# EAGLE design anode_pcb (EAGLE 6.6.0)
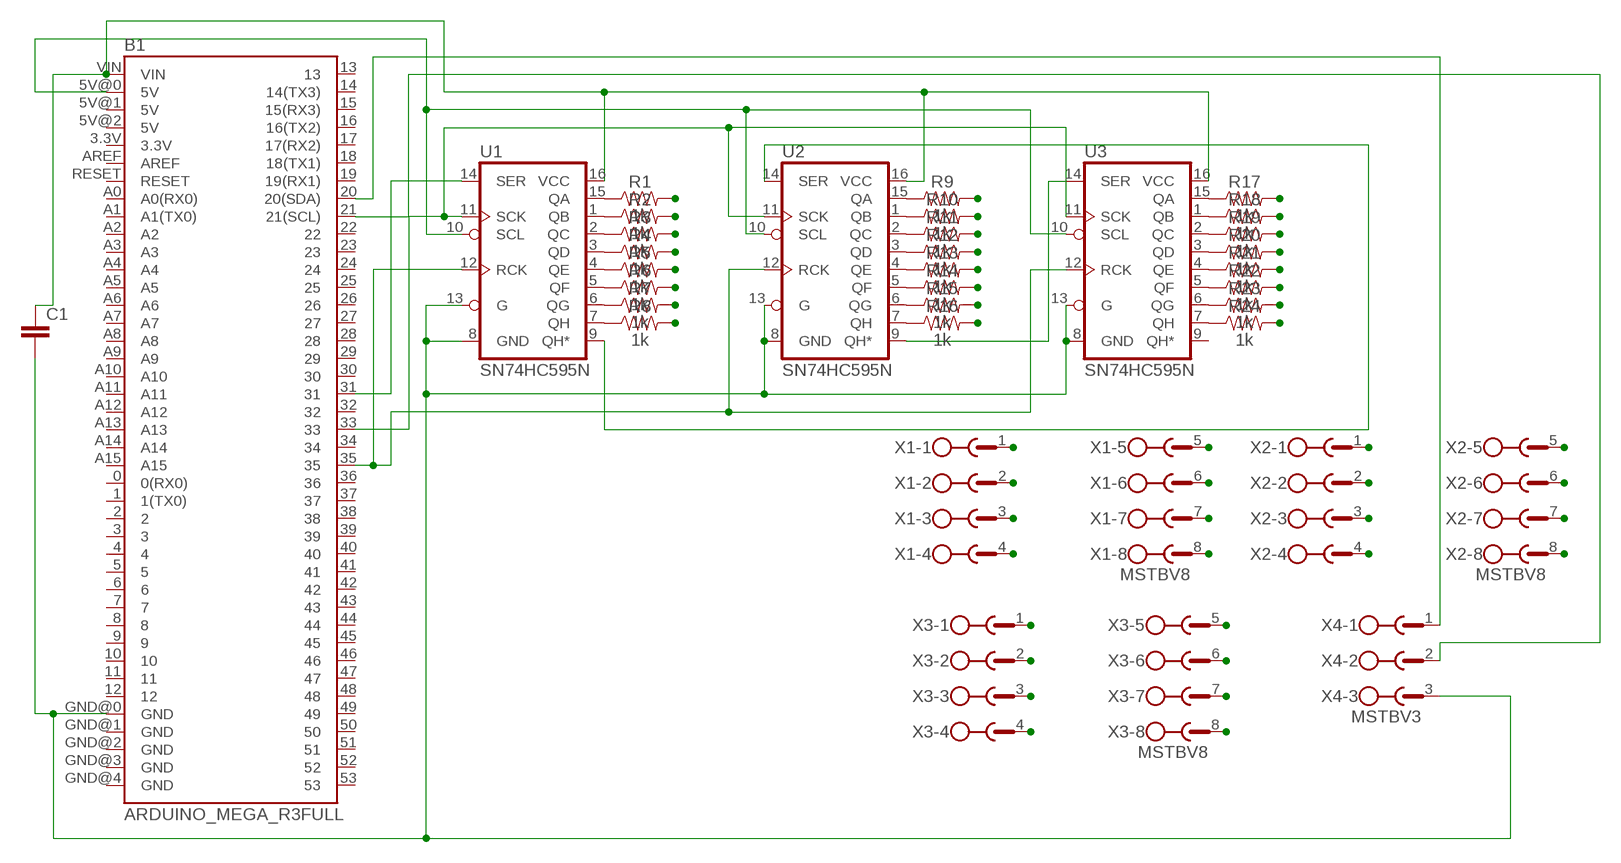
[diagram p0: schematic, sheet 1]

## Parts
B1  ARDUINO_MEGA_R3FULL  [ARDUINO_MEGA]
C1  C2.5/2  [C2.5-2]
R1  1k  1KOHM-HORIZ-1/4W-5%  [AXIAL-0.3]
R2  1k  1KOHM-HORIZ-1/4W-5%  [AXIAL-0.3]
R3  1k  1KOHM-HORIZ-1/4W-5%  [AXIAL-0.3]
R4  1k  1KOHM-HORIZ-1/4W-5%  [AXIAL-0.3]
R5  1k  1KOHM-HORIZ-1/4W-5%  [AXIAL-0.3]
R6  1k  1KOHM-HORIZ-1/4W-5%  [AXIAL-0.3]
R7  1k  1KOHM-HORIZ-1/4W-5%  [AXIAL-0.3]
R8  1k  1KOHM-HORIZ-1/4W-5%  [AXIAL-0.3]
R9  1k  1KOHM-HORIZ-1/4W-5%  [AXIAL-0.3]
R10  1k  1KOHM-HORIZ-1/4W-5%  [AXIAL-0.3]
R11  1k  1KOHM-HORIZ-1/4W-5%  [AXIAL-0.3]
R12  1k  1KOHM-HORIZ-1/4W-5%  [AXIAL-0.3]
R13  1k  1KOHM-HORIZ-1/4W-5%  [AXIAL-0.3]
R14  1k  1KOHM-HORIZ-1/4W-5%  [AXIAL-0.3]
R15  1k  1KOHM-HORIZ-1/4W-5%  [AXIAL-0.3]
R16  1k  1KOHM-HORIZ-1/4W-5%  [AXIAL-0.3]
R17  1k  1KOHM-HORIZ-1/4W-5%  [AXIAL-0.3]
R18  1k  1KOHM-HORIZ-1/4W-5%  [AXIAL-0.3]
R19  1k  1KOHM-HORIZ-1/4W-5%  [AXIAL-0.3]
R20  1k  1KOHM-HORIZ-1/4W-5%  [AXIAL-0.3]
R21  1k  1KOHM-HORIZ-1/4W-5%  [AXIAL-0.3]
R22  1k  1KOHM-HORIZ-1/4W-5%  [AXIAL-0.3]
R23  1k  1KOHM-HORIZ-1/4W-5%  [AXIAL-0.3]
R24  1k  1KOHM-HORIZ-1/4W-5%  [AXIAL-0.3]
U1  SN74HC595N  74HC595N  [DIP16]
U2  SN74HC595N  74HC595N  [DIP16]
U3  SN74HC595N  74HC595N  [DIP16]
X1  MSTBV8  [MSTBV8]
X2  MSTBV8  [MSTBV8]
X3  MSTBV8  [MSTBV8]
X4  MSTBV3  [MSTBV3]

## Nets
A1: R1.P$2 X1.1
A2: R2.P$2 X1.2
A3: R3.P$2 X1.3
A4: R4.P$2 X1.4
A5: R5.P$2 X1.5
A6: R6.P$2 X1.6
A7: R7.P$2 X1.7
A8: R8.P$2 X1.8
A9: R9.P$2 X2.1
A10: R10.P$2 X2.2
A11: R11.P$2 X2.3
A12: R12.P$2 X2.4
A13: R13.P$2 X2.5
A14: R14.P$2 X2.6
A15: R15.P$2 X2.7
A16: R16.P$2 X2.8
A17: R17.P$2 X3.1
A18: R18.P$2 X3.2
A19: R19.P$2 X3.3
A20: R20.P$2 X3.4
A21: R21.P$2 X3.5
A22: R22.P$2 X3.6
A23: R23.P$2 X3.7
A24: R24.P$2 X3.8
N$1: B1.5V@0(5V) U1.10(SCL) U2.10(SCL) U3.10(SCL)
N$2: R1.P$1 U1.15(QA)
N$3: B1.GND@0(GND) C1.2 U1.8(GND) U1.13(G) U2.8(GND) U2.13(G) U3.8(GND) U3.13(G) X4.3
N$4: R2.P$1 U1.1(QB)
N$5: R4.P$1 U1.3(QD)
N$6: R5.P$1 U1.4(QE)
N$7: R6.P$1 U1.5(QF)
N$8: R3.P$1 U1.2(QC)
N$9: R7.P$1 U1.6(QG)
N$10: R8.P$1 U1.7(QH)
N$11: B1.20(20(SDA)) X4.1
N$12: B1.21(21(SCL)) X4.2
N$19: R9.P$1 U2.15(QA)
N$20: R10.P$1 U2.1(QB)
N$21: R11.P$1 U2.2(QC)
N$22: R12.P$1 U2.3(QD)
N$23: R13.P$1 U2.4(QE)
N$24: R14.P$1 U2.5(QF)
N$25: R15.P$1 U2.6(QG)
N$26: R16.P$1 U2.7(QH)
N$27: R17.P$1 U3.15(QA)
N$28: R18.P$1 U3.1(QB)
N$29: R19.P$1 U3.2(QC)
N$30: R20.P$1 U3.3(QD)
N$31: R21.P$1 U3.4(QE)
N$32: R22.P$1 U3.5(QF)
N$33: R23.P$1 U3.6(QG)
N$34: R24.P$1 U3.7(QH)
N$51: B1.33 U1.11(SCK) U2.11(SCK) U3.11(SCK)
N$52: U2.9(QH*) U3.14(SER)
N$53: U1.9(QH*) U2.14(SER)
N$54: B1.31 U1.14(SER)
N$56: B1.35 U1.12(RCK) U2.12(RCK) U3.12(RCK)
N$59: B1.VIN C1.1 U1.16(VCC) U2.16(VCC) U3.16(VCC)
Unconnected: B1.0(0(RX0)) B1.1(1(TX0)) B1.2 B1.3 B1.3.3V B1.4 B1.5 B1.5V@1(5V) B1.5V@2(5V) B1.6 B1.7 B1.8 B1.9 B1.10 B1.11 B1.12 B1.13 B1.14(14(TX3)) B1.15(15(RX3)) B1.16(16(TX2)) B1.17(17(RX2)) B1.18(18(TX1)) B1.19(19(RX1)) B1.22 B1.23 B1.24 B1.25 B1.26 B1.27 B1.28 B1.29 B1.30 B1.32 B1.34 B1.36 B1.37 B1.38 B1.39 B1.40 B1.41 B1.42 B1.43 B1.44 B1.45 B1.46 B1.47 B1.48 B1.49 B1.50 B1.51 B1.52 B1.53 B1.A0(A0(RX0)) B1.A1(A1(TX0)) B1.A2 B1.A3 B1.A4 B1.A5 B1.A6 B1.A7 B1.A8 B1.A9 B1.A10 B1.A11 B1.A12 B1.A13 B1.A14 B1.A15 B1.AREF B1.GND@1(GND) B1.GND@2(GND) B1.GND@3(GND) B1.GND@4(GND) B1.RESET U3.9(QH*)

## Library data of the parts
B1 = SparkFun-Boards:ARDUINO_MEGA_R3: Arduino Mega R3 ATmega2560 R3 compatible footprint. SparkFun Products: Arduino Mega 2560 R3 <https://www.sparkfun.com/products/11061>
C1 = capacitor-wima:C: CAPACITOR naming: grid - package width
R1-R24 = SparkFun-Resistors:1KOHM: 1kΩ resistor A resistor is a passive two-terminal electrical component that implements electrical resistance as a circuit element. Resistors act to reduce current flow, and, at the same time, act to lower voltage levels within circuits. - Wikipedia; PROD_ID: RES-08380
U1-U3 = SparkFun-IC-Logic:74*595: 8-Bit Shift Register (Serial to Parallel) Datasheet <http://cdn.sparkfun.com/datasheets/BreakoutBoards/MM74HC595.pdf> SparkFun Products SparkFun Shift Register Breakout - 74HC595 <https://www.sparkfun.com/products/10680> (BOB-10680); PROD_ID: IC-13123
X1-X3 = con-phoenix-508:MSTBV8: PHOENIX; MPN: MSTBV 2,5/8-GF-5.08; OC_FARNELL: 1792797; OC_NEWARK: 69R9850
X4 = con-phoenix-508:MSTBV3: PHOENIX; MPN: MSTBV 2,5/3-GF-5.08; OC_FARNELL: 1792793; OC_NEWARK: 69R9846

## Board
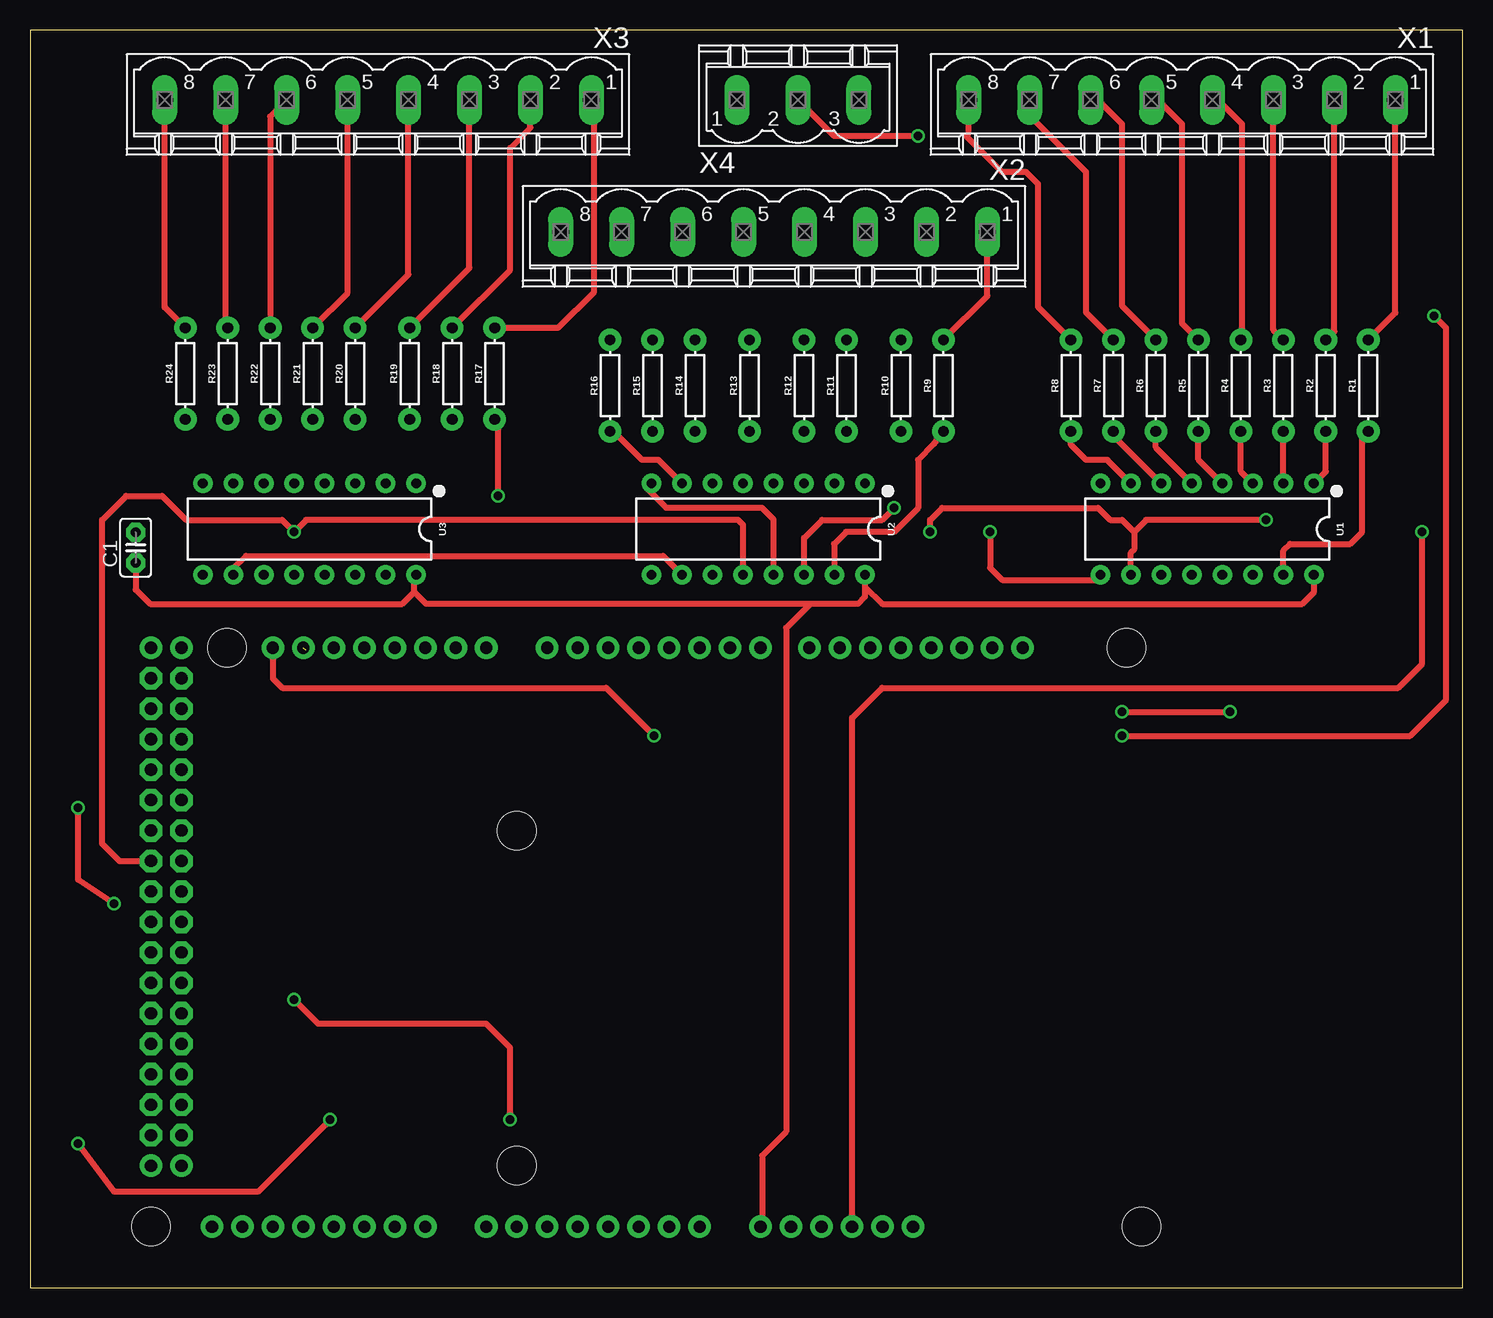
[diagram p1: board, top side]
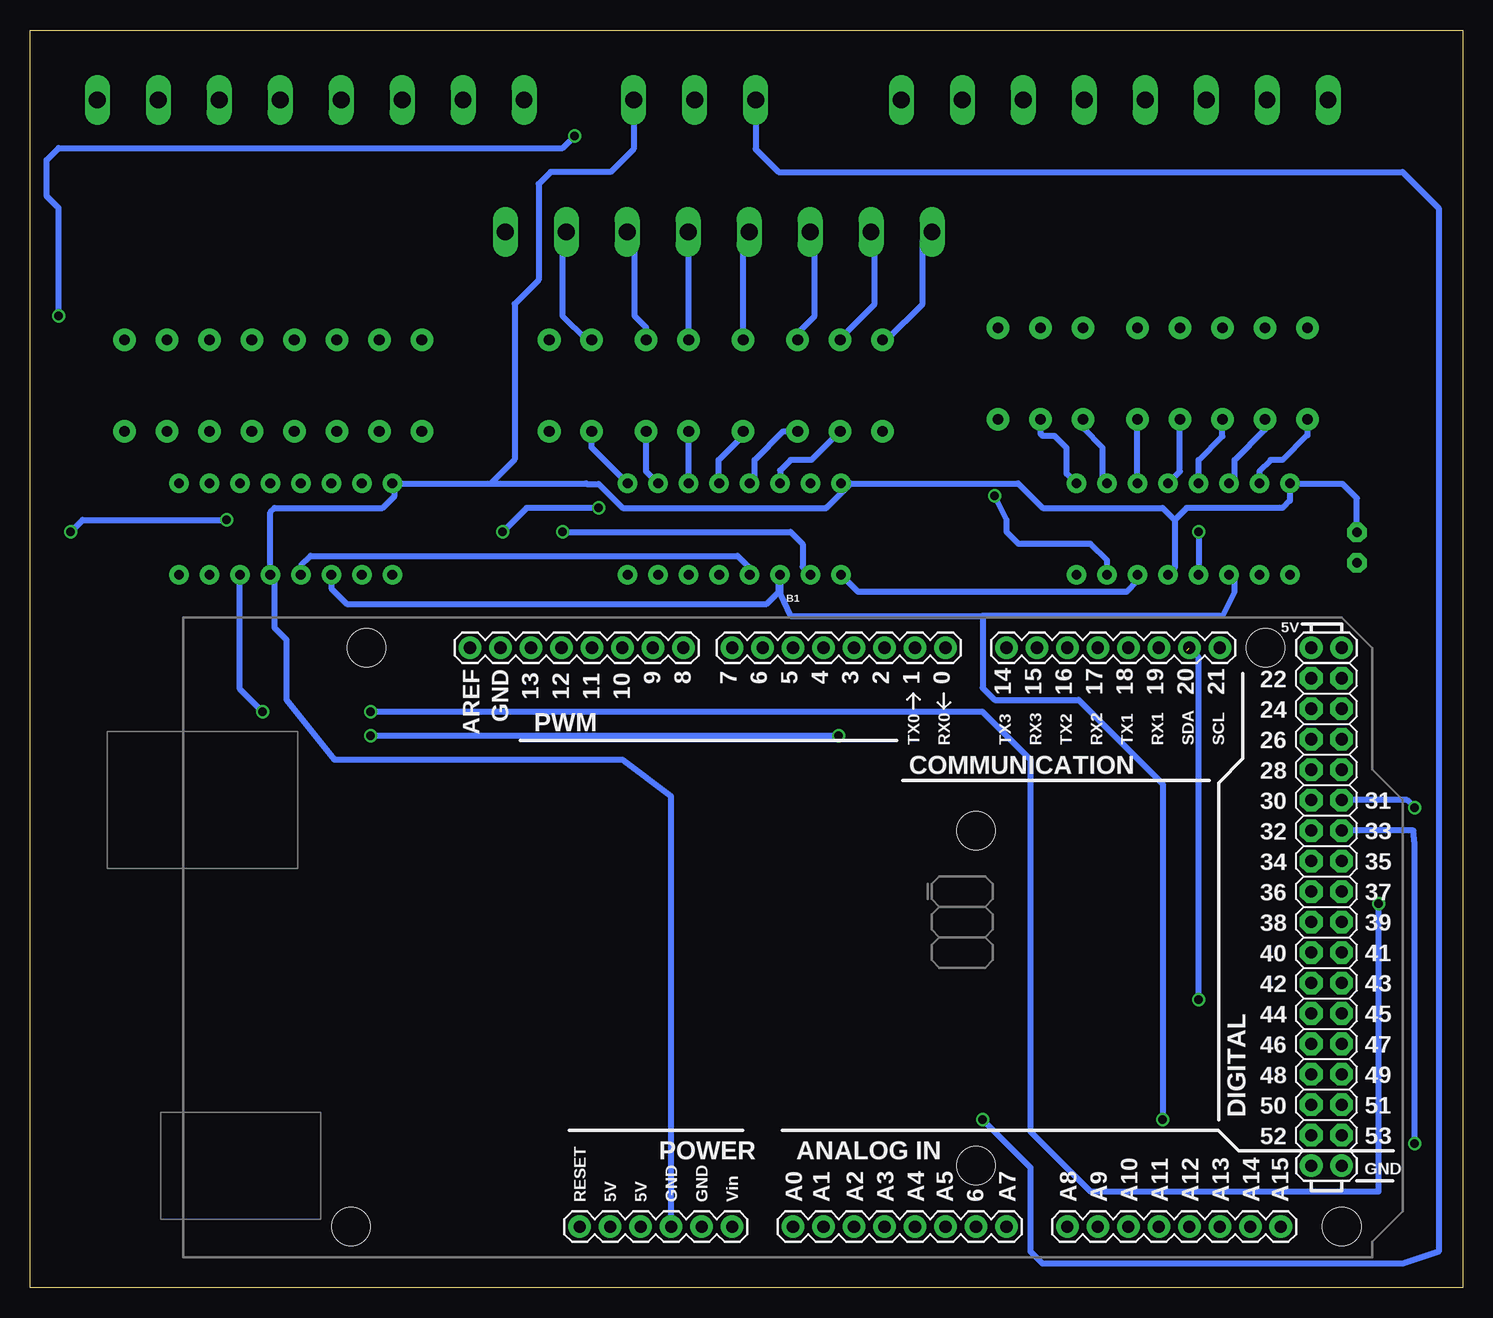
[diagram p2: board, bottom side, seen from below]

Size 119.39 x 104.84 mm. Coordinates in mm from the lower left corner, seen from the top.
Outline: 0,0 119.39,0 119.39,104.84 0,104.84 0,0
Copper layers (1*16): Top 0.035mm / dielectric 1.5mm / Bottom 0.035mm
Design rules "default": minimum track width 10mil, minimum drill 24mil, track to track 8mil, track to pad 8mil, pad to pad 8mil, via to via 8mil, smd to smd 8mil, copper to edge 40mil, drill to drill 8mil, minimum pad ring 10mil, minimum via ring 8mil, stop-mask expansion 4mil, vias tented up to drill 0mil, thermal gap 10mil

### Footprints (pad centres in the part's own frame; a part is rotated, then mirrored left to right if it is on the bottom)
ARDUINO_MEGA = drill 1.016 pad 1.88: 0 13.97,24.13; 1 11.43,24.13; 2 8.89,24.13; 3 6.35,24.13; 3.3V -13.97,-24.13; 4 3.81,24.13; 5 1.27,24.13; 5V@0 -11.43,-24.13; 5V@1 44.45,24.13; 5V@2 46.99,24.13; 6 -1.27,24.13; 7 -3.81,24.13; 8 -7.874,24.13; 9 -10.414,24.13; 10 -12.954,24.13; 11 -15.494,24.13; 12 -18.034,24.13; 13 -20.574,24.13; 14 19.05,24.13; 15 21.59,24.13; 16 24.13,24.13; 17 26.67,24.13; 18 29.21,24.13; 19 31.75,24.13; 20 34.29,24.13; 21 36.83,24.13; A0 1.27,-24.13; A1 3.81,-24.13; A2 6.35,-24.13; A3 8.89,-24.13; A4 11.43,-24.13; A5 13.97,-24.13; A6 16.51,-24.13; A7 19.05,-24.13; A8 24.13,-24.13; A9 26.67,-24.13; A10 29.21,-24.13; A11 31.75,-24.13; A12 34.29,-24.13; A13 36.83,-24.13; A14 39.37,-24.13; A15 41.91,-24.13; AREF -25.654,24.13; GND@0 -8.89,-24.13; GND@1 -6.35,-24.13; GND@2 44.45,-19.05; GND@3 46.99,-19.05; GND@4 -23.114,24.13; RESET -16.51,-24.13; VIN -3.81,-24.13 | drill 1.016 pad 1.88 octagon: 22 44.45,21.59; 23 46.99,21.59; 24 44.45,19.05; 25 46.99,19.05; 26 44.45,16.51; 27 46.99,16.51; 28 44.45,13.97; 29 46.99,13.97; 30 44.45,11.43; 31 46.99,11.43; 32 44.45,8.89; 33 46.99,8.89; 34 44.45,6.35; 35 46.99,6.35; 36 44.45,3.81; 37 46.99,3.81; 38 44.45,1.27; 39 46.99,1.27; 40 44.45,-1.27; 41 46.99,-1.27; 42 44.45,-3.81; 43 46.99,-3.81; 44 44.45,-6.35; 45 46.99,-6.35; 46 44.45,-8.89; 47 46.99,-8.89; 48 44.45,-11.43; 49 46.99,-11.43; 50 44.45,-13.97; 51 46.99,-13.97; 52 44.45,-16.51; 53 46.99,-16.51 | hole 3.2: -34.29,24.13; -35.56,-24.13; 16.51,8.89; 16.51,-19.05; 40.64,24.13; 46.99,-24.13
C2.5-2 = drill 0.813 pad 1.6 octagon: 1 -1.27,0; 2 1.27,0
AXIAL-0.3 = drill 0.9 pad 1.88: P$1 -3.81,0; P$2 3.81,0
DIP16 = drill 0.813 pad 1.626: 1 -8.89,-3.81; 2 -6.35,-3.81; 3 -3.81,-3.81; 4 -1.27,-3.81; 5 1.27,-3.81; 6 3.81,-3.81; 7 6.35,-3.81; 8 8.89,-3.81; 9 8.89,3.81; 10 6.35,3.81; 11 3.81,3.81; 12 1.27,3.81; 13 -1.27,3.81; 14 -3.81,3.81; 15 -6.35,3.81; 16 -8.89,3.81
MSTBV8 = drill 1.397 long: 1 -17.78,0; 2 -12.7,0; 3 -7.62,0; 4 -2.54,0; 5 2.54,0; 6 7.62,0; 7 12.7,0; 8 17.78,0
MSTBV3 = drill 1.397 long: 1 -5.08,0; 2 0,0; 3 5.08,0

### Placement (x,y rotation side)
B1  57.07,29.21 0 bottom
C1  8.81,61.69 90 top
R1  111.52,75.2 90 top
R2  107.98,75.2 90 top
R3  104.44,75.2 90 top
R4  100.9,75.2 90 top
R5  97.36,75.2 90 top
R6  93.82,75.2 90 top
R7  90.28,75.2 90 top
R8  86.74,75.2 90 top
R9  76.12,75.2 90 top
R10  72.58,75.2 90 top
R11  68.04,75.2 90 top
R12  64.5,75.2 90 top
R13  59.96,75.2 90 top
R14  55.42,75.2 90 top
R15  51.88,75.2 90 top
R16  48.34,75.2 90 top
R17  38.72,76.2 90 top
R18  35.18,76.2 90 top
R19  31.64,76.2 90 top
R20  27.1,76.2 90 top
R21  23.56,76.2 90 top
R22  20.02,76.2 90 top
R23  16.48,76.2 90 top
R24  12.94,76.2 90 top
U1  98.09,63.23 180 top
U2  60.69,63.23 180 top
U3  23.29,63.23 180 top
X1  96,99 180 top
X2  62,88 180 top
X3  29,99 180 top
X4  64,99 0 top

### Tracks (layer width: path | path; a pad name or v marks a point on that pad's centre or on a via)
A1
  Top 0.5: R1.P$2 113.78,81.27 X1.1
A2
  Top 0.5: R2.P$2 108.7,79.73 X1.2
A3
  Top 0.5: R3.P$2 103.62,79.83 X1.3
A4
  Top 0.5: R4.P$2 101,79.11 101,97 99,99 X1.4
A5
  Top 0.5: R5.P$2 96,80.37 96,97 94,99 X1.5
A6
  Top 0.5: R6.P$2 91,81.83 91,97 89,99 X1.6
A7
  Top 0.5: R7.P$2 88,81.29 88,93 83.3,97.7 X1.7
A8
  Top 0.5: R8.P$2 84,81.75 84,92 83,93 81,93 78,96 78.22,96.22 X1.8
A9
  Top 0.5: R9.P$2 79.78,82.67 X2.1
A10
  Bottom 0.5: R10.P$2 73.01,79.01 75,81 75,87.7 X2.2
A11
  Bottom 0.5: R11.P$2 68.04,80.04 69,81 69,87.38 X2.3
A12
  Bottom 0.5: R12.P$2 64.5,87.96 X2.4
A13
  Bottom 0.5: R13.P$2 59.96,87.5 X2.5
A14
  Bottom 0.5: R14.P$2 55.42,79.58 54,81 54,87.62 X2.6
A15
  Bottom 0.5: R15.P$2 51.88,79.12 49,82 49,87.7 X2.7
A16
  Bottom 0.5: R16.P$2 47.99,79.01 45,82 45,87.22 X2.8
A17
  Top 0.5: R17.P$2 44.01,80.01 47,83 47,98.78 X3.1
A18
  Top 0.5: R18.P$2 40,84.83 40,95 41.7,96.7 X3.2
A19
  Top 0.5: R19.P$2 36.62,84.99 X3.3
A20
  Top 0.5: R20.P$2 31.54,84.45 X3.4
A21
  Top 0.5: R21.P$2 26.46,82.91 X3.5
A22
  Top 0.5: X3.6 20.02,97.64 R22.P$2
A23
  Top 0.5: R23.P$2 16.3,80.19 X3.7
A24
  Top 0.5: R24.P$2 11.22,81.73 X3.8
N$1  (via drill 0.7)
  Top 0.5: U3.10 16.94,59.94 18,61 52.76,61 U2.10 | U1.10 91.74,61.26 92,61.52 92,63 | v75,63 75,64 76,65 89,65 90,64 91,64 92,63 | B1.5V@0 68.5,47.5 71,50 114,50 116,52 v116,63 | v103,64 93,64 92,63
  Bottom 0.5: v75,63 56,63 55,62 55,60.08 U2.10 | v116,63 115,64 v103,64
N$2
  Top 0.5: U1.15 104.44,61.44 105,62 110,62 111,63 111,70.87 R1.P$1
N$3
  Top 0.5: U2.13 61.96,64.04 61,65 53,65 53,65.04 51.52,66.52 51.52,66.76 U2.8
  Bottom 0.5: C1.2 8.81,65.81 10,67 14.36,67 U3.8 14.4,65.6 15,65 23,65 24,64 | 24,64 24,59.98 U3.13 | U2.8 51,67.04 | 81,67.04 U1.8 89,66.84 89,66 90,65 99,65 99.36,64.64 U1.13 99,59.06 99,55 98,54 98,49 94,44 70,44 65.96,40.96 B1.GND@0 | 81,67.04 73.04,67.04 73,67 72,67 70,65 53,65 53,65.04 51,67.04 | 51,67.04 37.04,67.04 35,65 25,65 24,64 | X4.3 69.08,94.92 71,93 76,93 77,92 77,84 79,82 79,69.04 81,67.04
N$4
  Top 0.5: U1.1 107.98,68.04 R2.P$1
N$5
  Top 0.5: U1.3 100.9,68.04 R4.P$1
N$6
  Top 0.5: U1.4 97.36,69.04 R5.P$1
N$7
  Top 0.5: U1.5 93.82,70.04 R6.P$1
N$8
  Top 0.5: U1.2 R3.P$1
N$9
  Top 0.5: U1.6 90.28,71.04 R7.P$1
N$10
  Top 0.5: U1.7 89.78,69 88,69 86.74,70.26 R8.P$1
N$11  (via drill 0.7)  (1 unrouted)
  Top 0.5: v40,14 40,20 38,22 24,22 v22,24
  Bottom 0.5: X4.1 58.92,94.92 57,93 5,93 2,90 2,3 5,2 35,2 36,3 36,10 v40,14 | v22,24 22,52.56 B1.20
N$12  (via drill 0.7)
  Top 0.5: B1.21 20.24,50.76 21,50 48,50 v52,46 | v91,46 115,46 118,49 118,80 v117,81 | v74,96 67,96 X4.2
  Bottom 0.5: v52,46 v91,46 | v74,96 75,95 117,95 118,94 118,91 117,90 v117,81
N$19
  Top 0.5: R9.P$1 75.31,70.31 74,69 74,65 72,63 68,63 67,62 67,59.46 U2.15
N$20
  Bottom 0.5: U2.1 72.58,70.04 R10.P$1
N$21
  Bottom 0.5: U2.2 68.04,68.04 R11.P$1
N$22
  Bottom 0.5: U2.3 R12.P$1
N$23
  Bottom 0.5: U2.4 62,67.08 62,69 59.96,71.04 R13.P$1
N$24
  Bottom 0.5: U2.5 59,67.46 59,69 56.61,71.39 R14.P$1
N$25
  Bottom 0.5: R15.P$1 54.27,69 56,69 56.88,68.12 U2.6
N$26
  Top 0.5: U2.7 52.38,69 51,69 48.61,71.39 R16.P$1
N$27  (via drill 0.7)
  Top 0.5: v39,66 39,72.11 R17.P$1
  Bottom 0.5: U3.15 29.64,60.64 31,62 37,62 38,63 38,64 v39,66
N$28
  Bottom 0.5: U3.1 33,67.86 33,70 34,71 35,71 35.18,71.18 R18.P$1
N$29
  Bottom 0.5: U3.2 30,67.4 30,70 31.64,71.64 R19.P$1
N$30
  Bottom 0.5: U3.3 R20.P$1
N$31
  Bottom 0.5: U3.4 23.56,68.04 R21.P$1
N$32
  Bottom 0.5: U3.5 22,67.06 22,69 20.02,70.98 R22.P$1
N$33
  Bottom 0.5: U3.6 19,67.52 19,69 16.48,71.52 R23.P$1
N$34
  Bottom 0.5: R24.P$1 12.94,71.06 15,69 16,69 16.94,68.06 U3.7
N$51  (via drill 0.7)
  Top 0.5: v25,14 19,8 7,8 v4,12
  Bottom 0.5: U1.11 94.28,58.28 93,57 58,57 57,58 57,59.3 U2.11 56.88,57.88 56,56 40,56 | U3.11 19,58.94 19,58 20,56 40,56 | 40,56 40,50 39,49 32,49 25,42 v25,14 | v4,12 4,37 4.1,38.1 B1.33
N$52
  Bottom 0.5: U3.14 27.1,58.9 28,58 50.38,58 U2.9
N$53  (via drill 0.7)
  Top 0.5: U2.14 64.5,62.5 66,64 71,64 v72,65 | v80,63 80,60 81,59 88.78,59 U1.9
  Bottom 0.5: v72,65 78,65 v80,63
N$54  (via drill 0.7)
  Top 0.5: v91,48 v100,48 | v7,32 4,34 v4,40
  Bottom 0.5: v91,48 40,48 36,44 36,13 31,8 7,8 v7,32 | v100,48 101.9,49.9 U1.14 | v4,40 4.64,40.64 B1.31
N$56  (via drill 0.7)
  Top 0.5: U2.12 59.42,63.58 59,64 23,64 v22,63 21,64 13,64 11,66 8,66 6,64 6,37 7.44,35.56 B1.35
  Bottom 0.5: v22,63 22,59.44 U3.12 | U1.12 96.82,60.18 96,61 60.42,61 59.42,60 U2.12
N$59
  Top 0.5: 65,57 33,57 32,58 | 32,58 32,59.24 U3.16 | C1.1 8.81,58.19 10,57 31,57 32,58 | U1.16 107,59.4 107,58 106,57 71,57 69.58,58.42 U2.16 69.58,57.58 69,57 65,57 | 65,57 63,55 63,13 61,11 61,5.2 B1.VIN